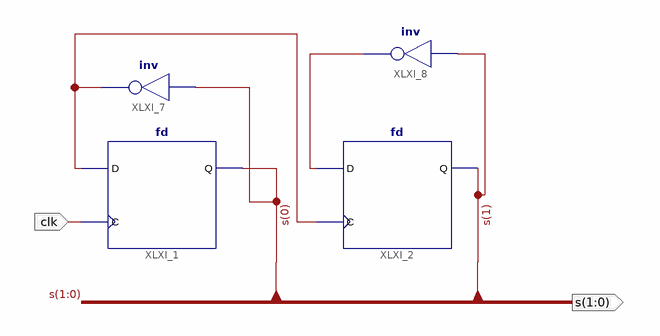
[diagram p0: schematic sheet 1]
// Xilinx ISE schematic counter.sch (spartan6) as structural Verilog: 4 symbols, 2 ports
module counter (
  input  clk,
  output [1:0] s
);

  wire XLXN_6, XLXN_16;

  fd XLXI_2 (.C(XLXN_6), .D(XLXN_16), .Q(s[1]));
  fd XLXI_1 (.C(clk), .D(XLXN_6), .Q(s[0]));
  not XLXI_7 (XLXN_6, s[0]);
  not XLXI_8 (XLXN_16, s[1]);
endmodule
